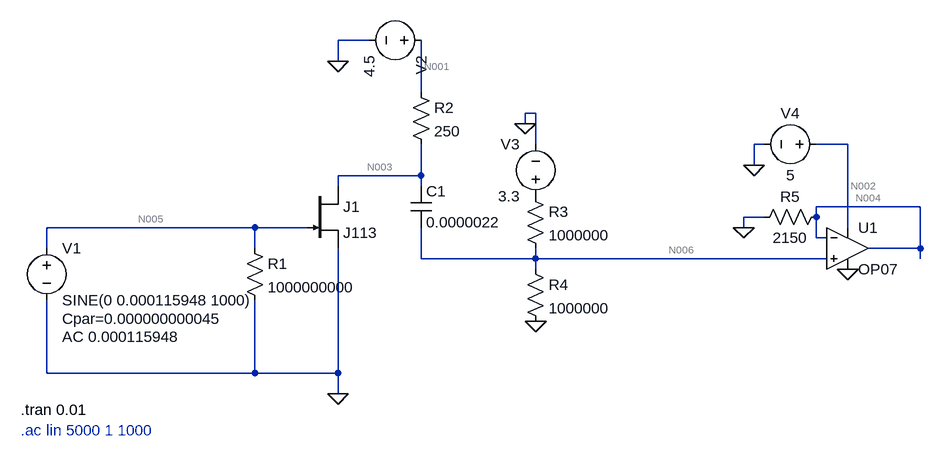
[diagram p0: schematic Mic.asc]
Mic.asc, the LTspice schematic file:
Version 4.1
SHEET 1 1928 792
WIRE 704 -48 656 -48
WIRE 656 -16 656 -48
WIRE 784 32 784 -48
WIRE 960 64 944 64
WIRE 944 80 944 64
WIRE 960 112 960 64
WIRE 1312 112 1296 112
WIRE 1440 112 1392 112
WIRE 1296 144 1296 112
WIRE 784 160 784 112
WIRE 784 160 656 160
WIRE 656 176 656 160
WIRE 784 176 784 160
WIRE 1552 208 1392 208
WIRE 1312 224 1280 224
WIRE 1392 224 1392 208
WIRE 528 240 208 240
WIRE 608 240 528 240
WIRE 1280 240 1280 224
WIRE 1440 240 1440 112
WIRE 1392 256 1392 224
WIRE 1408 256 1392 256
WIRE 208 272 208 240
WIRE 528 272 528 240
WIRE 1552 272 1552 208
WIRE 1552 272 1472 272
WIRE 784 288 784 240
WIRE 960 288 960 272
WIRE 960 288 784 288
WIRE 1408 288 960 288
WIRE 1552 288 1552 272
WIRE 960 304 960 288
WIRE 208 464 208 352
WIRE 528 464 528 352
WIRE 528 464 208 464
WIRE 656 464 656 272
WIRE 656 464 528 464
WIRE 656 496 656 464
FLAG 656 496 0
FLAG 656 -16 0
FLAG 960 384 0
FLAG 944 80 0
FLAG 1440 304 0
FLAG 1296 144 0
FLAG 1280 240 0
DATAFLAG 1152 288 ""
SYMBOL res 512 256 R0
SYMATTR InstName R1
SYMATTR Value 1000000000
SYMATTR SpiceLine tol=5
SYMBOL njf 608 176 R0
SYMATTR InstName J1
SYMATTR Value J113
SYMBOL voltage 208 256 R0
WINDOW 123 24 152 Left 2
WINDOW 39 24 124 Left 2
SYMATTR Value2 AC 0.000115948
SYMATTR SpiceLine Cpar=0.000000000045
SYMATTR InstName V1
SYMATTR Value SINE(0 0.000115948 1000)
SYMBOL voltage 800 -48 R90
WINDOW 123 0 0 Left 0
WINDOW 39 0 0 Left 0
SYMATTR InstName V2
SYMATTR Value 4.5
SYMBOL res 768 16 R0
SYMATTR InstName R2
SYMATTR Value 250
SYMBOL cap 768 176 R0
SYMATTR InstName C1
SYMATTR Value 0.0000022
SYMBOL res 944 176 R0
SYMATTR InstName R3
SYMATTR Value 1000000
SYMBOL res 944 288 R0
SYMATTR InstName R4
SYMATTR Value 1000000
SYMBOL voltage 960 208 R180
WINDOW 0 24 96 Left 2
WINDOW 3 24 16 Left 2
WINDOW 123 0 0 Left 0
WINDOW 39 0 0 Left 0
SYMATTR InstName V3
SYMATTR Value 3.3
SYMBOL OpAmps\\OP07 1440 208 R0
SYMATTR InstName U1
SYMBOL voltage 1408 112 R90
WINDOW 0 -32 56 VBottom 2
WINDOW 3 32 56 VTop 2
WINDOW 123 0 0 Left 0
WINDOW 39 0 0 Left 0
SYMATTR InstName V4
SYMATTR Value 5
SYMBOL res 1408 208 R90
WINDOW 0 0 56 VBottom 2
WINDOW 3 32 56 VTop 2
SYMATTR InstName R5
SYMATTR Value 2150
TEXT 168 520 Left 2 !.tran 0.01
TEXT 168 552 Left 2 ;.ac lin 5000 1 1000

The netlist it stands for:
* Mic.asc
R1 N005 0 1000000000 tol=5
J1 N003 N005 0 J113
V1 N005 0 SINE(0 0.000115948 1000) AC 0.000115948 Cpar=0.000000000045
V2 N001 0 4.5
R2 N001 N003 250
C1 N003 N006 0.0000022
R3 P001 N006 1000000
R4 N006 0 1000000
V3 P001 0 3.3
X§U1 N006 N004 N002 0 N004 LT1001  ; OP07, pins In+ In- V+ V- OUT
V4 N002 0 5
R5 N004 0 2150
.model NJF NJF
.model PJF PJF
.lib standard.jft
.tran 0.01
* .ac lin 5000 1 1000
.lib LTC.lib
.backanno
.end

* Results of the author's LTspice run, read from the files saved beside the schematic
* Operating Point, zero values left out:
*   V(n003) = 863.8 mV
*   V(n006) = 1.65 V
*   V(p001) = 3.3 V
*   V(n002) = 5 V
*   V(n001) = 4.5 V
*   V(n004) = 1.65 V
*   I(V1) = 4.202 pA
*   I(R2) = 14.54 mA
*   I(R4) = 1.65 µA
*   I(R3) = 1.65 µA
*   I(R5) = 767.4 µA
*   Id(J1) = 14.54 mA
*   Ig(J1) = -4.202 pA
*   Is(J1) = -14.54 mA
*   I(V2) = -14.54 mA
*   I(V3) = -1.65 µA
*   I(V4) = -2.65 mA
*   Ix(u1:1) = -1.533 pA
*   Ix(u1:2) = -1.503 pA
*   Ix(u1:3) = 2.65 mA
*   Ix(u1:4) = -1.883 mA
*   Ix(u1:5) = -767.4 µA
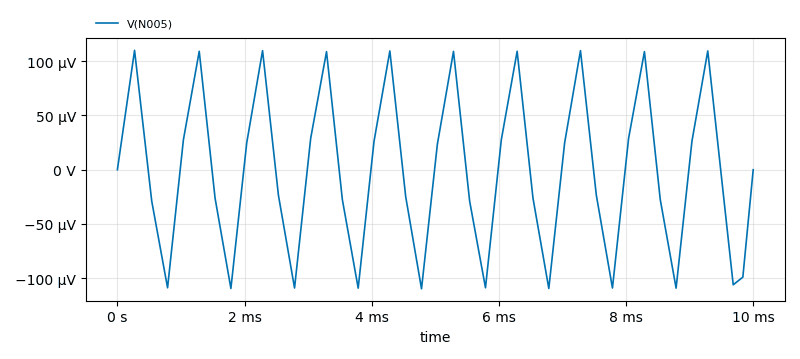
[diagram p1: Transient Analysis of Mic.asc, plotted from the saved traces]
* Transient Analysis, 1 run:
*   V(N005): min -109.8 µV, max 110 µV, average -716.9 nV, rms 79.68 µV, last 0 V